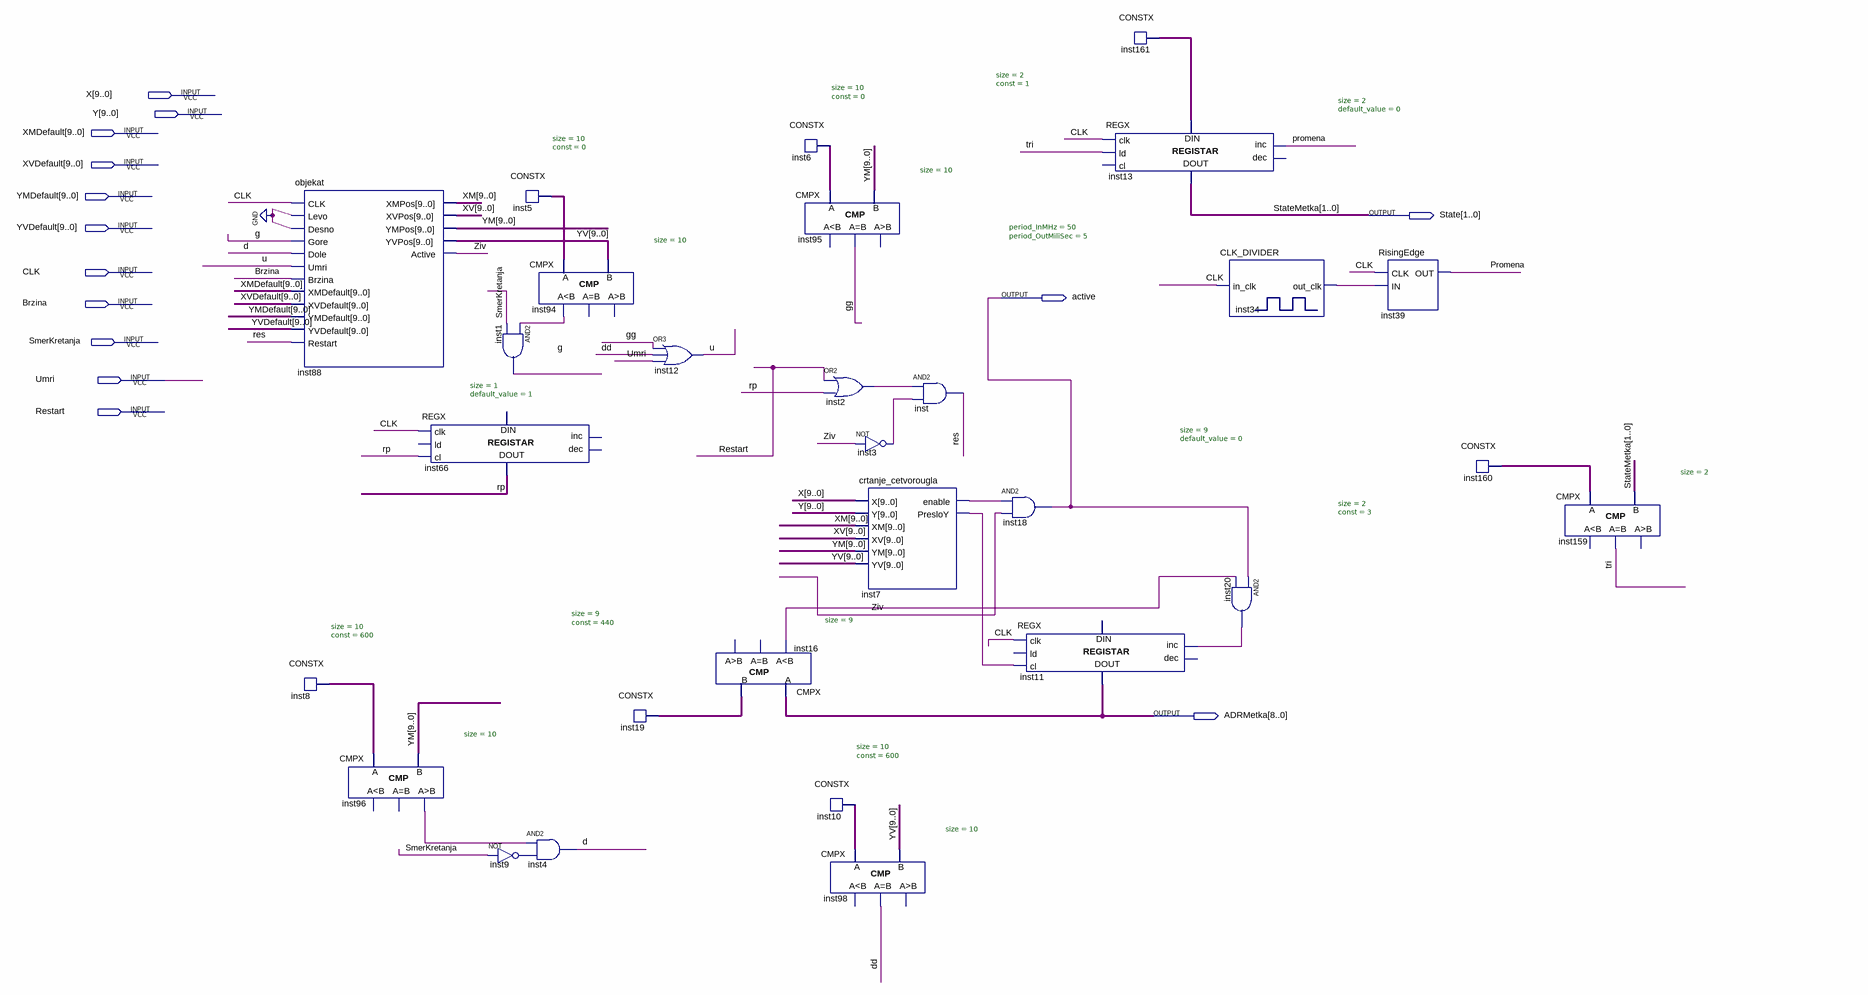
[diagram p0: schematic sheet]
// Quartus schematic metak.bdf as structural Verilog: 29 symbols, 14 pins
module metak (
  input  [9:0] X,
  input  [9:0] Y,
  input  [9:0] XMDefault,
  input  [9:0] XVDefault,
  input  [9:0] YMDefault,
  input  [9:0] YVDefault,
  input  CLK,
  input  Brzina,
  input  SmerKretanja,
  input  Umri,
  input  Restart,
  output [1:0] State,
  output active,
  output [8:0] ADRMetka
);

  wire d, dd, g, gg, inst2_out, inst3_out, inst7_enable, inst7_presloy, inst9_out, inst16_ls, inst20_out,
       inst34_out_clk, inst94_ls, inst96_gr, Promena, res, rp, \tri , u, Ziv;
  wire [1:0] inst160_data, inst161_data;
  wire [8:0] inst19_data;
  wire [9:0] inst5_data, inst6_data, inst8_data, inst10_data, XM, XV, YM, YV;

  objekat inst88 (
    .CLK(CLK), .Levo(1'b0), .Desno(1'b0), .Gore(g), .Dole(d), .Umri(u), .Brzina(Brzina),
    .XMDefault(XMDefault), .XVDefault(XVDefault), .YMDefault(YMDefault), .YVDefault(YVDefault),
    .Restart(res), .XMPos(XM), .XVPos(XV), .YMPos(YM), .YVPos(YV), .Active(Ziv));
  CONSTX #(.size(10), .\const (600)) inst8 (.data(inst8_data));
  CMPX #(.size(10)) inst96 (.A(inst8_data), .B(YM), .gr(inst96_gr));  // open: ls, eq
  REGX #(.size(1), .default_value(1)) inst66 (.clk(CLK), .cl(rp), .data_out(rp));  // open: ld, inc, dec, data_in
  CONSTX #(.size(10), .\const (0)) inst5 (.data(inst5_data));
  and inst1 (g, inst94_ls, SmerKretanja);
  not inst9 (inst9_out, SmerKretanja);
  CMPX #(.size(10)) inst94 (.A(inst5_data), .B(YV), .ls(inst94_ls));  // open: eq, gr
  and inst4 (d, inst96_gr, inst9_out);
  CONSTX #(.size(9), .\const (440)) inst19 (.data(inst19_data));
  or inst12 (u, gg, dd, Umri);
  CMPX #(.size(9)) inst16 (.A(ADRMetka), .B(inst19_data), .ls(inst16_ls));  // open: eq, gr
  CONSTX #(.size(10), .\const (0)) inst6 (.data(inst6_data));
  CMPX #(.size(10)) inst95 (.A(inst6_data), .B(YM), .eq(gg));  // open: ls, gr
  or inst2 (inst2_out, Restart, rp);
  CONSTX #(.size(10), .\const (600)) inst10 (.data(inst10_data));
  CMPX #(.size(10)) inst98 (.A(inst10_data), .B(YV), .eq(dd));  // open: ls, gr
  not inst3 (inst3_out, Ziv);
  crtanje_cetvorougla inst7 (
    .X(X), .Y(Y), .XM(XM), .XV(XV), .YM(YM), .YV(YV), .enable(inst7_enable), .PresloY(inst7_presloy));
  and inst (res, inst2_out, inst3_out);
  and inst18 (active, inst7_enable, Ziv);
  REGX #(.size(9), .default_value(0)) inst11 (
    .clk(CLK), .cl(inst7_presloy), .inc(inst20_out), .data_out(ADRMetka));  // open: ld, dec, data_in
  CONSTX #(.size(2), .\const (1)) inst161 (.data(inst161_data));
  REGX #(.size(2), .default_value(0)) inst13 (
    .clk(CLK), .ld(\tri ), .inc(Promena), .data_in(inst161_data), .data_out(State));  // open: cl, dec
  CLK_DIVIDER #(.period_InMHz(50), .period_OutMiliSec(5)) inst34 (.in_clk(CLK), .out_clk(inst34_out_clk));
  and inst20 (inst20_out, active, inst16_ls);
  RisingEdge inst39 (.CLK(CLK), .IN(inst34_out_clk), .OUT(Promena));
  CONSTX #(.size(2), .\const (3)) inst160 (.data(inst160_data));
  CMPX #(.size(2)) inst159 (.A(inst160_data), .B(State), .eq(\tri ));  // open: ls, gr

  // Other names for the same wires on the sheet: StateMetka[1:0] = State
endmodule
